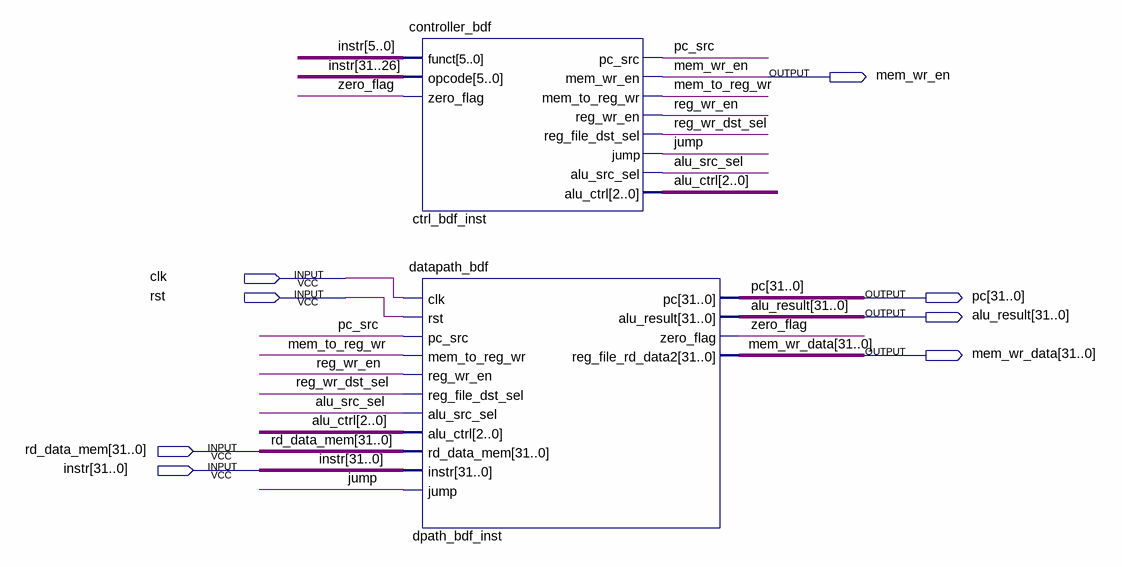
[diagram p0: schematic sheet]
// Quartus schematic processor.bdf as structural Verilog: 2 symbols, 8 pins
module processor (
  input  clk,
  input  rst,
  input  [31:0] rd_data_mem,
  input  [31:0] instr,
  output mem_wr_en,
  output [31:0] pc,
  output [31:0] alu_result,
  output [31:0] mem_wr_data
);

  wire alu_src_sel, jump, mem_to_reg_wr, pc_src, reg_wr_dst_sel, reg_wr_en, zero_flag;
  wire [2:0] alu_ctrl;

  controller_bdf ctrl_bdf_inst (
    .funct(instr[5:0]), .opcode(instr[31:26]), .zero_flag(zero_flag), .pc_src(pc_src), .mem_wr_en(mem_wr_en),
    .mem_to_reg_wr(mem_to_reg_wr), .reg_wr_en(reg_wr_en), .reg_file_dst_sel(reg_wr_dst_sel), .jump(jump),
    .alu_src_sel(alu_src_sel), .alu_ctrl(alu_ctrl));
  datapath_bdf dpath_bdf_inst (
    .clk(clk), .rst(rst), .pc_src(pc_src), .mem_to_reg_wr(mem_to_reg_wr), .reg_wr_en(reg_wr_en),
    .reg_file_dst_sel(reg_wr_dst_sel), .alu_src_sel(alu_src_sel), .alu_ctrl(alu_ctrl),
    .rd_data_mem(rd_data_mem), .instr(instr), .jump(jump), .pc(pc), .alu_result(alu_result),
    .zero_flag(zero_flag), .reg_file_rd_data2(mem_wr_data));
endmodule
